# EAGLE design f280049_boost_robotics (EAGLE 9.1.3)

## Sheet 1 of 2
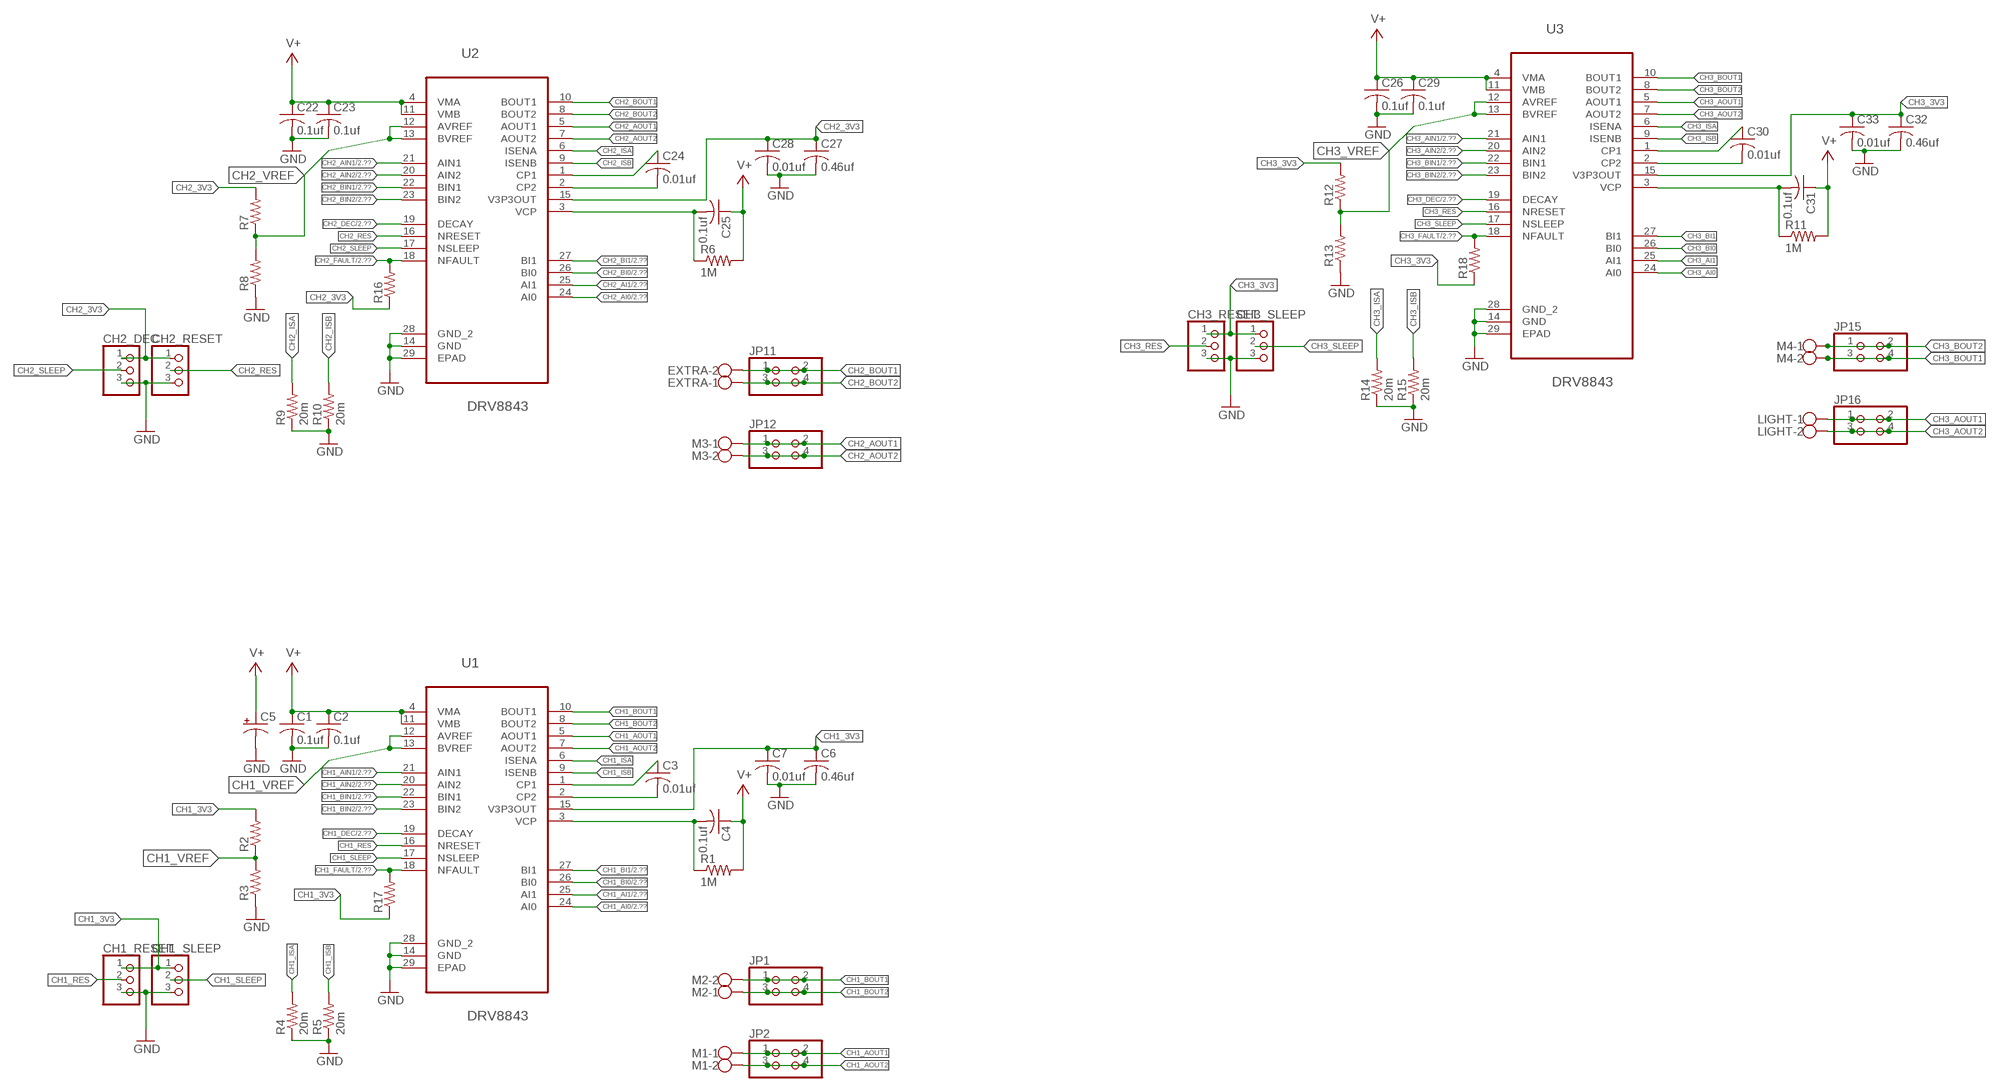
[diagram p0: schematic, sheet 1]

### Parts
C1  0.1uf  C-USC0603K  [C0603K]
C2  0.1uf  C-USC0603K  [C0603K]
C3  0.01uf  C-USC0603K  [C0603K]
C4  0.1uf  C-USC0603K  [C0603K]
C5  CPOL-USE5-8.5  [E5-8,5]
C6  0.46uf  C-USC0603K  [C0603K]
C7  0.01uf  C-USC0603K  [C0603K]
C22  0.1uf  C-USC0603K  [C0603K]
C23  0.1uf  C-USC0603K  [C0603K]
C24  0.01uf  C-USC0603K  [C0603K]
C25  0.1uf  C-USC0603K  [C0603K]
C26  0.1uf  C-USC0603K  [C0603K]
C27  0.46uf  C-USC0603K  [C0603K]
C28  0.01uf  C-USC0603K  [C0603K]
C29  0.1uf  C-USC0603K  [C0603K]
C30  0.01uf  C-USC0603K  [C0603K]
C31  0.1uf  C-USC0603K  [C0603K]
C32  0.46uf  C-USC0603K  [C0603K]
C33  0.01uf  C-USC0603K  [C0603K]
CH1_RESET  PINHD-1X3  [1X03]
CH1_SLEEP  PINHD-1X3  [1X03]
CH2_DEC  PINHD-1X3  [1X03]
CH2_RESET  PINHD-1X3  [1X03]
CH3_RESET  PINHD-1X3  [1X03]
CH3_SLEEP  PINHD-1X3  [1X03]
EXTRA  W237-102  [W237-102]
JP1  PINHD-2X2  [2X02]
JP2  PINHD-2X2  [2X02]
JP11  PINHD-2X2  [2X02]
JP12  PINHD-2X2  [2X02]
JP15  PINHD-2X2  [2X02]
JP16  PINHD-2X2  [2X02]
LIGHT  W237-102  [W237-102]
M1  W237-102  [W237-102]
M2  W237-102  [W237-102]
M3  W237-102  [W237-102]
M4  W237-102  [W237-102]
R1  1M  R-US_R0402  [R0402]
R2  R-US_R0402  [R0402]
R3  R-US_R0402  [R0402]
R4  20m  R-US_R0402  [R0402]
R5  20m  R-US_R0402  [R0402]
R6  1M  R-US_R0402  [R0402]
R7  R-US_R0402  [R0402]
R8  R-US_R0402  [R0402]
R9  20m  R-US_R0402  [R0402]
R10  20m  R-US_R0402  [R0402]
R11  1M  R-US_R0402  [R0402]
R12  R-US_R0402  [R0402]
R13  R-US_R0402  [R0402]
R14  20m  R-US_R0402  [R0402]
R15  20m  R-US_R0402  [R0402]
R16  R-US_R0402  [R0402]
R17  R-US_R0402  [R0402]
R18  R-US_R0402  [R0402]
U1  DRV8843  [SOP65P640X120-29N]
U2  DRV8843  [SOP65P640X120-29N]
U3  DRV8843  [SOP65P640X120-29N]

### Nets
CH1_3V3: C6.1 C7.1 CH1_RESET.1 CH1_SLEEP.1 R2.2 R17.1 U1.15(V3P3OUT)
CH1_AI0: U1.24(AI0) ; also sheet 2
CH1_AI1: U1.25(AI1) ; also sheet 2
CH1_AIN1: U1.21(AIN1) ; also sheet 2
CH1_AIN2: U1.20(AIN2) ; also sheet 2
CH1_AOUT1: JP2.1 JP2.2 M1.1 U1.5(AOUT1)
CH1_AOUT2: JP2.3 JP2.4 M1.2 U1.7(AOUT2)
CH1_BI0: U1.26(BI0) ; also sheet 2
CH1_BI1: U1.27(BI1) ; also sheet 2
CH1_BIN1: U1.22(BIN1) ; also sheet 2
CH1_BIN2: U1.23(BIN2) ; also sheet 2
CH1_BOUT1: JP1.1 JP1.2 M2.2 U1.10(BOUT1)
CH1_BOUT2: JP1.3 JP1.4 M2.1 U1.8(BOUT2)
CH1_DEC: U1.19(DECAY) ; also sheet 2
CH1_FAULT: R17.2 U1.18(NFAULT) ; also sheet 2
CH1_ISA: R4.2 U1.6(ISENA)
CH1_ISB: R5.2 U1.9(ISENB)
CH1_RES: CH1_RESET.2 U1.16(NRESET)
CH1_SLEEP: CH1_SLEEP.2 U1.17(NSLEEP)
CH1_VREF: R2.1 R3.2 U1.12(AVREF) U1.13(BVREF)
CH2_3V3: C27.1 C28.1 CH2_DEC.1 CH2_RESET.1 R7.2 R16.1 U2.15(V3P3OUT)
CH2_AI0: U2.24(AI0) ; also sheet 2
CH2_AI1: U2.25(AI1) ; also sheet 2
CH2_AIN1: U2.21(AIN1) ; also sheet 2
CH2_AIN2: U2.20(AIN2) ; also sheet 2
CH2_AOUT1: JP12.1 JP12.2 M3.1 U2.5(AOUT1)
CH2_AOUT2: JP12.3 JP12.4 M3.2 U2.7(AOUT2)
CH2_BI0: U2.26(BI0) ; also sheet 2
CH2_BI1: U2.27(BI1) ; also sheet 2
CH2_BIN1: U2.22(BIN1) ; also sheet 2
CH2_BIN2: U2.23(BIN2) ; also sheet 2
CH2_BOUT1: EXTRA.2 JP11.1 JP11.2 U2.10(BOUT1)
CH2_BOUT2: EXTRA.1 JP11.3 JP11.4 U2.8(BOUT2)
CH2_DEC: U2.19(DECAY) ; also sheet 2
CH2_FAULT: R16.2 U2.18(NFAULT) ; also sheet 2
CH2_ISA: R9.2 U2.6(ISENA)
CH2_ISB: R10.2 U2.9(ISENB)
CH2_RES: CH2_RESET.2 U2.16(NRESET)
CH2_SLEEP: CH2_DEC.2 U2.17(NSLEEP)
CH2_VREF: R7.1 R8.2 U2.12(AVREF) U2.13(BVREF)
CH3_3V3: C32.1 C33.1 CH3_RESET.1 CH3_SLEEP.1 R12.2 R18.1 U3.15(V3P3OUT)
CH3_AI0: U3.24(AI0)
CH3_AI1: U3.25(AI1)
CH3_AIN1: U3.21(AIN1) ; also sheet 2
CH3_AIN2: U3.20(AIN2) ; also sheet 2
CH3_AOUT1: JP16.1 JP16.2 LIGHT.1 U3.5(AOUT1)
CH3_AOUT2: JP16.3 JP16.4 LIGHT.2 U3.7(AOUT2)
CH3_BI0: U3.26(BI0)
CH3_BI1: U3.27(BI1)
CH3_BIN1: U3.22(BIN1) ; also sheet 2
CH3_BIN2: U3.23(BIN2) ; also sheet 2
CH3_BOUT1: JP15.3 JP15.4 M4.2 U3.10(BOUT1)
CH3_BOUT2: JP15.1 JP15.2 M4.1 U3.8(BOUT2)
CH3_DEC: U3.19(DECAY) ; also sheet 2
CH3_FAULT: R18.2 U3.18(NFAULT) ; also sheet 2
CH3_ISA: R14.2 U3.6(ISENA)
CH3_ISB: R15.2 U3.9(ISENB)
CH3_RES: CH3_RESET.2 U3.16(NRESET)
CH3_SLEEP: CH3_SLEEP.2 U3.17(NSLEEP)
CH3_VREF: R12.1 R13.2 U3.12(AVREF) U3.13(BVREF)
GND: C1.2 C2.2 C5.- C6.2 C7.2 C22.2 C23.2 C26.2 C27.2 C28.2 C29.2 C32.2 C33.2 CH1_RESET.3 CH1_SLEEP.3 CH2_DEC.3 CH2_RESET.3 CH3_RESET.3 CH3_SLEEP.3 R3.1 R4.1 R5.1 R8.1 R9.1 R10.1 R13.1 R14.1 R15.1 U1.14(GND) U1.28(GND_2) U1.29(EPAD) U2.14(GND) U2.28(GND_2) U2.29(EPAD) U3.14(GND) U3.28(GND_2) U3.29(EPAD) ; also sheet 2
N$1: C3.1 U1.1(CP1)
N$2: C3.2 U1.2(CP2)
N$3: C4.2 R1.1 U1.3(VCP)
N$4: C24.1 U2.1(CP1)
N$5: C24.2 U2.2(CP2)
N$15: C25.2 R6.1 U2.3(VCP)
N$16: C30.1 U3.1(CP1)
N$17: C30.2 U3.2(CP2)
N$18: C31.2 R11.1 U3.3(VCP)
V+: C1.1 C2.1 C4.1 C5.+ C22.1 C23.1 C25.1 C26.1 C29.1 C31.1 R1.2 R6.2 R11.2 U1.4(VMA) U1.11(VMB) U2.4(VMA) U2.11(VMB) U3.4(VMA) U3.11(VMB) ; also sheet 2

## Sheet 2 of 2
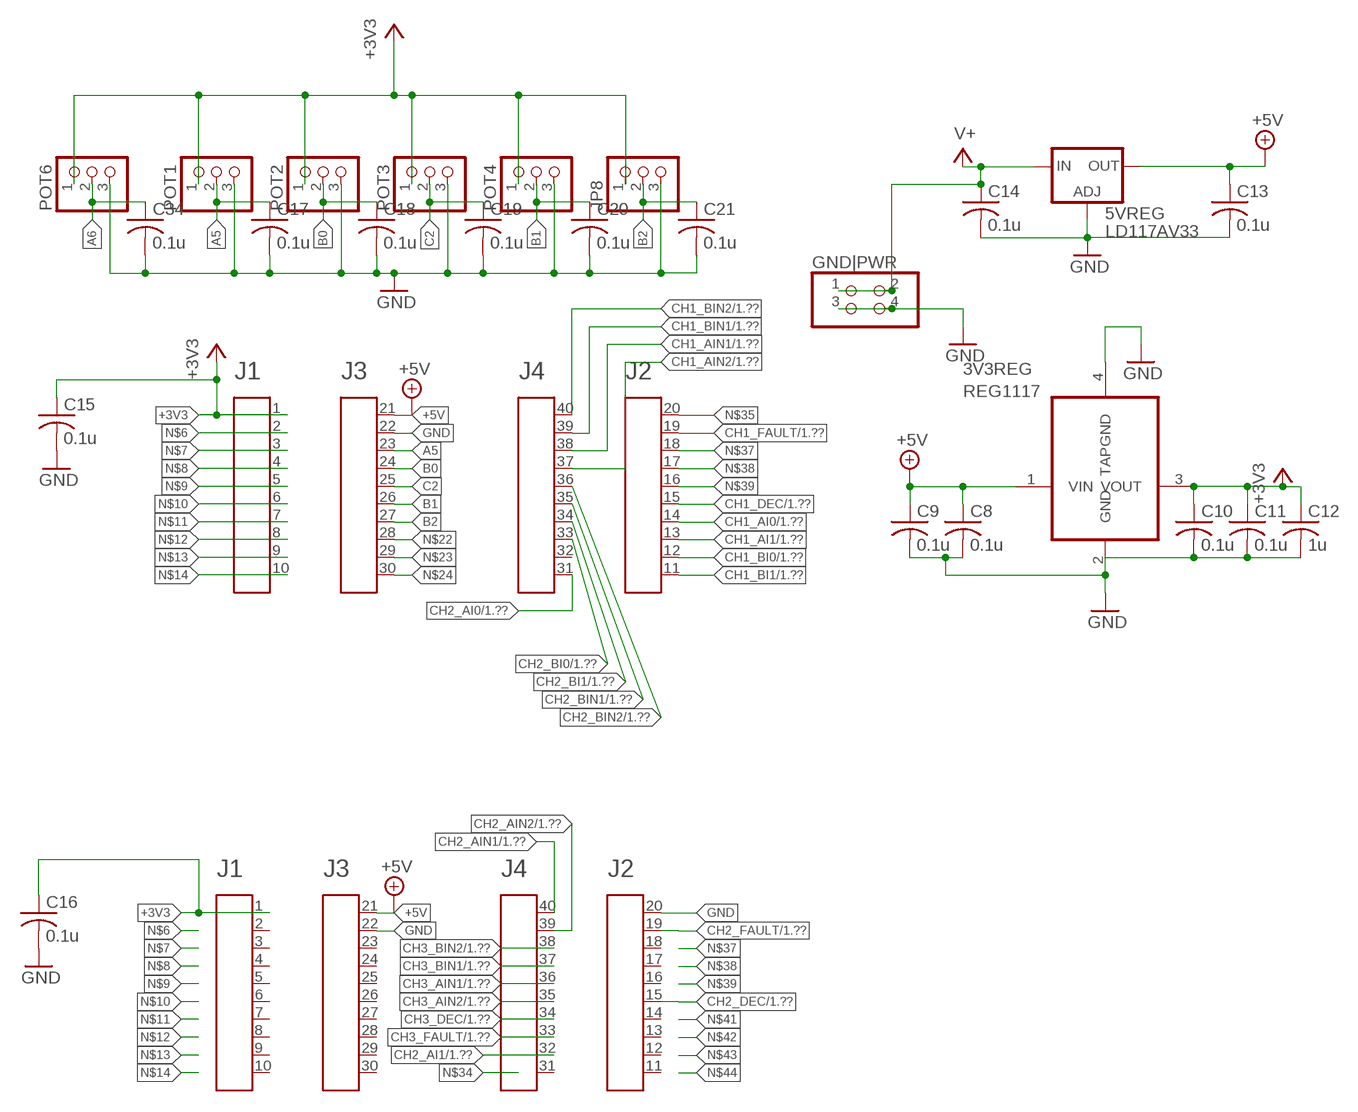
[diagram p1: schematic, sheet 2]

### Parts
3V3REG  REG1117  [SOT223]
5VREG  LD117AV33  [TO220L1]
A1  HEADER4X10-BOOSTERPACK  [4X10-BOOSTERPACK]
A2  HEADER4X10-BOOSTERPACK  [4X10-BOOSTERPACK]
C8  0.1u  C-USC0603K  [C0603K]
C9  0.1u  C-USC0603K  [C0603K]
C10  0.1u  C-USC0603K  [C0603K]
C11  0.1u  C-USC0603K  [C0603K]
C12  1u  C-USC0805K  [C0805K]
C13  0.1u  C-USC0603K  [C0603K]
C14  0.1u  C-USC0603K  [C0603K]
C15  0.1u  C-USC0603K  [C0603K]
C16  0.1u  C-USC0603K  [C0603K]
C17  0.1u  C-USC0603K  [C0603K]
C18  0.1u  C-USC0603K  [C0603K]
C19  0.1u  C-USC0603K  [C0603K]
C20  0.1u  C-USC0603K  [C0603K]
C21  0.1u  C-USC0603K  [C0603K]
C34  0.1u  C-USC0603K  [C0603K]
GND|PWR  PINHD-2X2  [2X02]
JP8  PINHD-1X3  [1X03]
POT1  PINHD-1X3  [1X03]
POT2  PINHD-1X3  [1X03]
POT3  PINHD-1X3  [1X03]
POT4  PINHD-1X3  [1X03]
POT6  PINHD-1X3  [1X03]

### Nets
+3V3: 3V3REG.3(VOUT) A1.1 A2.1 C10.1 C11.1 C12.1 C15.1 C16.1 JP8.1 POT1.1 POT2.1 POT3.1 POT4.1 POT6.1
+5V: 3V3REG.1(VIN) 5VREG.2(OUT) A1.21 A2.21 C8.1 C9.1 C13.1
A5: A2.23 C17.1 POT1.2
A6: C34.1 POT6.2
B0: A2.24 C18.1 POT2.2
B1: A2.26 C20.1 POT4.2
B2: A2.27 C21.1 JP8.2
C2: A2.25 C19.1 POT3.2
CH1_AI0: A2.14 ; also sheet 1
CH1_AI1: A2.13 ; also sheet 1
CH1_AIN1: A2.38 ; also sheet 1
CH1_AIN2: A2.37 ; also sheet 1
CH1_BI0: A2.12 ; also sheet 1
CH1_BI1: A2.11 ; also sheet 1
CH1_BIN1: A2.39 ; also sheet 1
CH1_BIN2: A2.40 ; also sheet 1
CH1_DEC: A2.15 ; also sheet 1
CH1_FAULT: A2.19 ; also sheet 1
CH2_AI0: A2.31 ; also sheet 1
CH2_AI1: A1.32 ; also sheet 1
CH2_AIN1: A1.40 ; also sheet 1
CH2_AIN2: A1.39 ; also sheet 1
CH2_BI0: A2.33 ; also sheet 1
CH2_BI1: A2.34 ; also sheet 1
CH2_BIN1: A2.35 ; also sheet 1
CH2_BIN2: A2.36 ; also sheet 1
CH2_DEC: A1.15 ; also sheet 1
CH2_FAULT: A1.19 ; also sheet 1
CH3_AIN1: A1.36 ; also sheet 1
CH3_AIN2: A1.35 ; also sheet 1
CH3_BIN1: A1.37 ; also sheet 1
CH3_BIN2: A1.38 ; also sheet 1
CH3_DEC: A1.34 ; also sheet 1
CH3_FAULT: A1.33 ; also sheet 1
GND: 3V3REG.2(GND) 3V3REG.4(TAPGND) 5VREG.1(ADJ) A1.20 A1.22 A2.22 C8.2 C9.2 C10.2 C11.2 C12.2 C13.2 C14.2 C15.2 C16.2 C17.2 C18.2 C19.2 C20.2 C21.2 C34.2 GND|PWR.3 GND|PWR.4 JP8.3 POT1.3 POT2.3 POT3.3 POT4.3 POT6.3 ; also sheet 1
N$6: A2.2
N$7: A2.3
N$8: A2.4
N$9: A2.5
N$10: A2.6
N$11: A2.7
N$12: A2.8
N$13: A2.9
N$14: A2.10
N$22: A2.28
N$23: A2.29
N$24: A2.30
N$35: A2.20
N$37: A2.18
N$38: A2.17
N$39: A2.16
V+: 5VREG.3(IN) C14.1 GND|PWR.1 GND|PWR.2 ; also sheet 1
Unconnected: A1.2 A1.3 A1.4 A1.5 A1.6 A1.7 A1.8 A1.9 A1.10 A1.11 A1.12 A1.13 A1.14 A1.16 A1.17 A1.18 A1.23 A1.24 A1.25 A1.26 A1.27 A1.28 A1.29 A1.30 A1.31 A2.32

## Library data of the parts
3V3REG = MSP-EXP430F5529LP:REG1117: 800mA and 1A Low Dropout (LDO) Positive Regulator 1.8V, 2.5V, 2.85V, 3.3V, 5V, and Adj; MPN: REG1117; OC_FARNELL: 1097566; OC_NEWARK: 14P6981
5VREG = v-reg:LD117A?*: Low drop fixed and adjustable positive voltage regulators 1 A Source: http://www.st.com/stonline/products/literature/ds/7194/ld1117axx.pdf
A1 A2 = EAGLE_BoosterPack_Library:HEADER4X10-BOOSTERPACK
C1-C4 C6-C34 = rcl:C-US: CAPACITOR, American symbol; SPICEPREFIX: C
C5 = rcl:CPOL-US: POLARIZED CAPACITOR, American symbol; SPICEPREFIX: C
CH1_RESET CH1_SLEEP CH2_DEC CH2_RESET CH3_RESET CH3_SLEEP JP8 POT1-POT4 POT6 = adafruit:PINHD-1X3: PIN HEADER
EXTRA LIGHT M1-M4 = con-wago-500:W237-102: WAGO SCREW CLAMP; MPN: 237-102; OC_FARNELL: unknown; OC_NEWARK: 70K9898
GND|PWR JP1 JP2 JP11 JP12 JP15 JP16 = pinhead:PINHD-2X2: PIN HEADER
R1-R18 = rcl:R-US_: RESISTOR, American symbol; SPICEPREFIX: R
U1-U3 = Texas Instruments_By_element14_Batch_1:DRV8843: H-BRIDGE MOTOR CONTROLLER IC; MPN: DRV8828PWP; OC_FARNELL: -; OC_NEWARK: 79R7959; PACKAGE: TSSOP-28; SUPPLIER: Texas Instruments

## Board
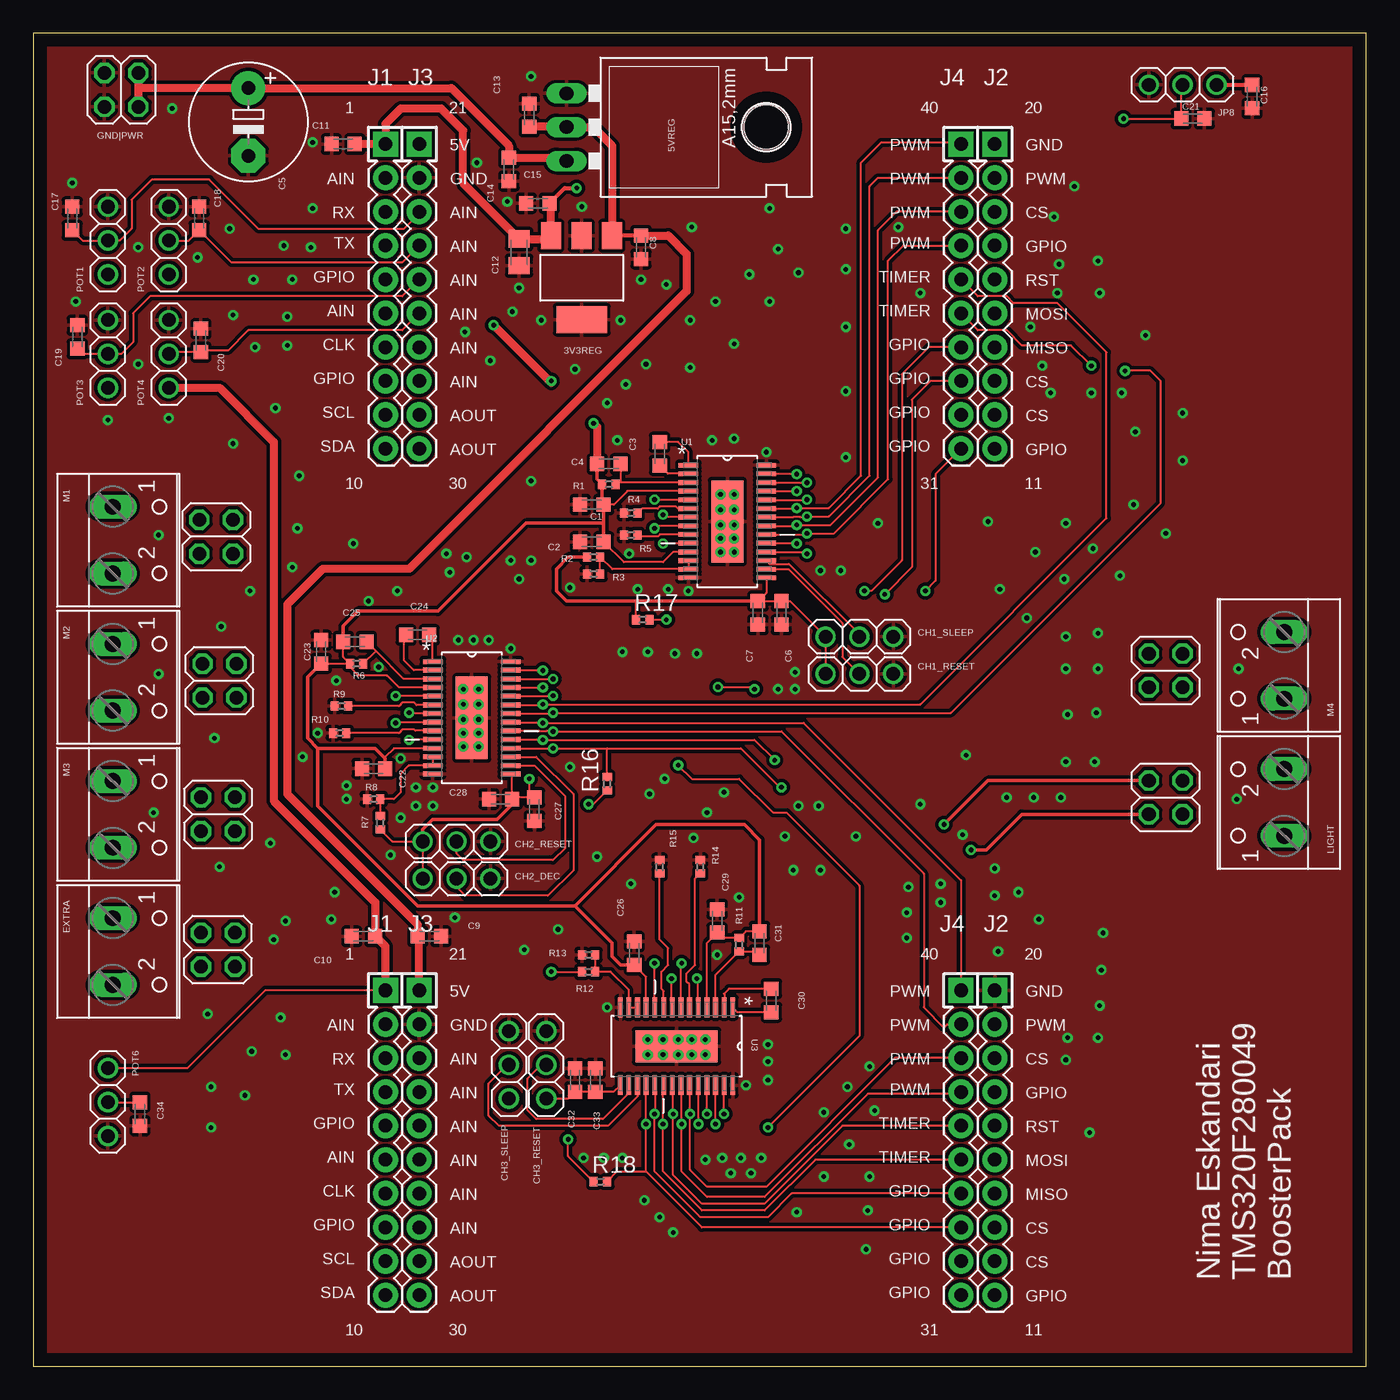
[diagram p2: board, top side]
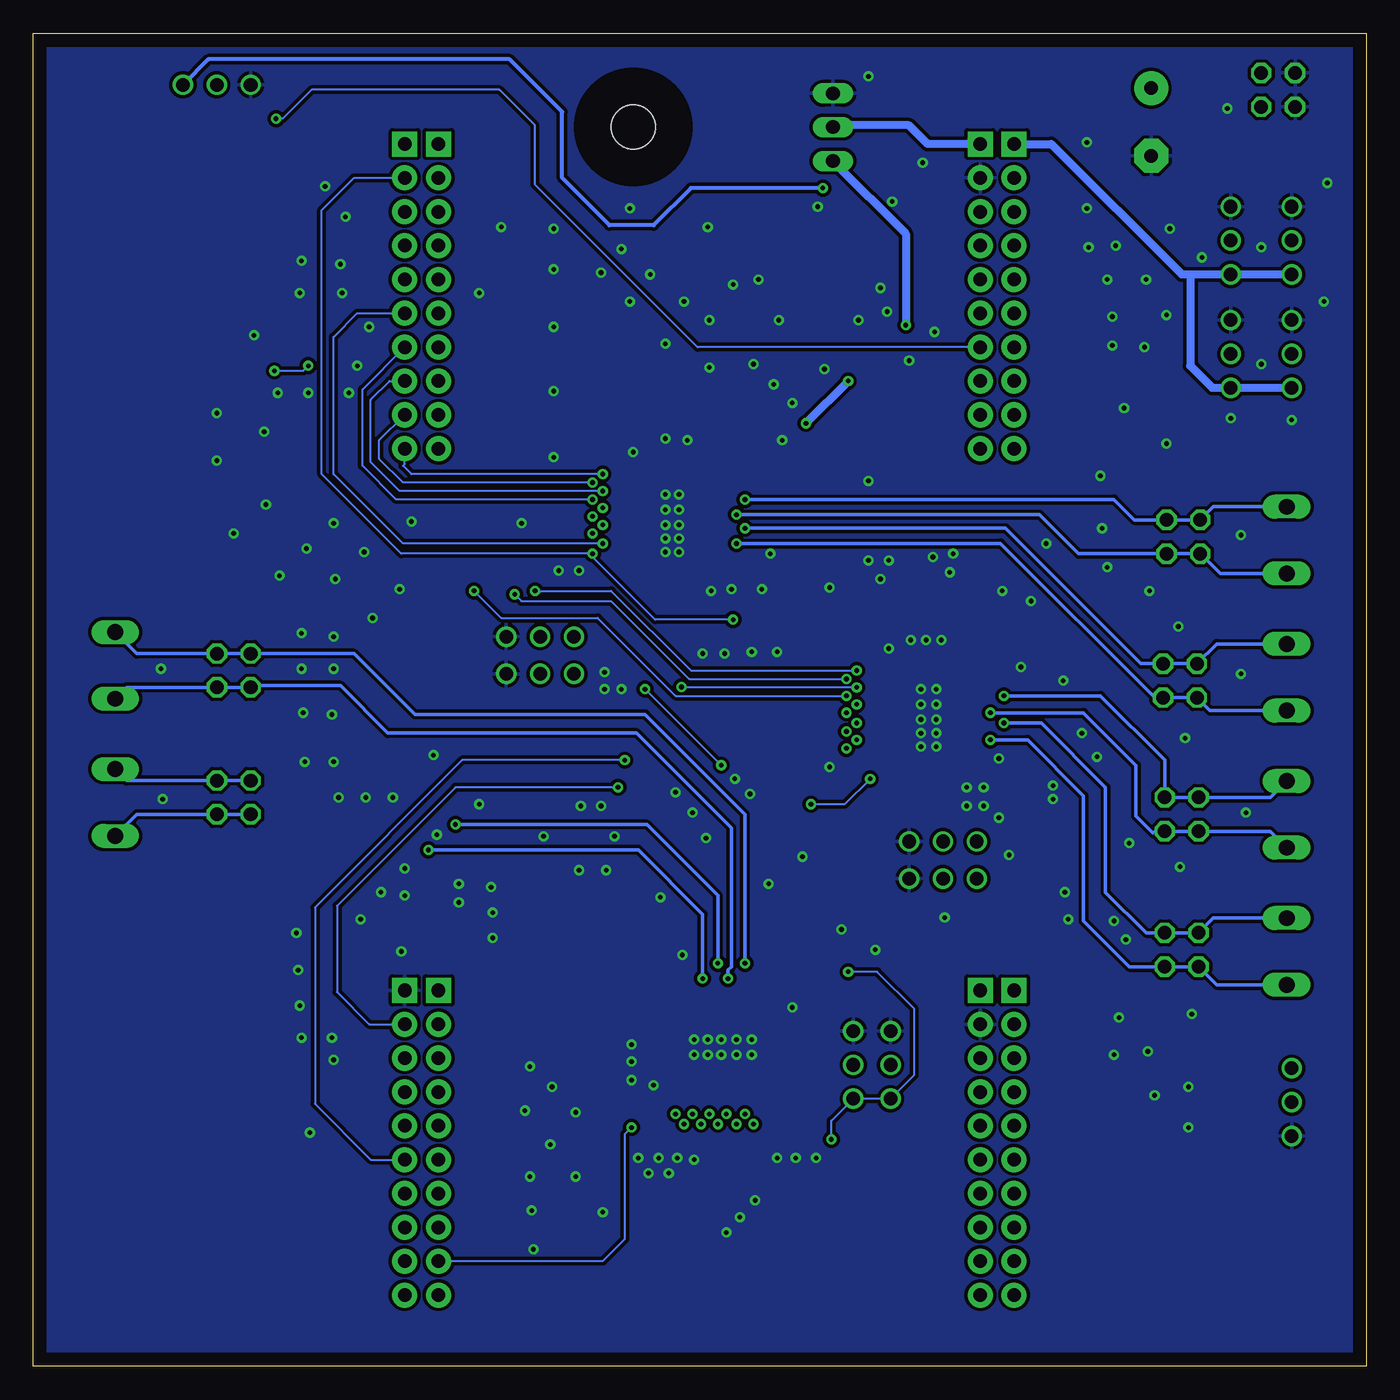
[diagram p3: board, bottom side, seen from below]

Size 100 x 100 mm. Coordinates in mm from the lower left corner, seen from the top.
Outline: 0,0 100,0 100,100 0,100 0,0
Copper layers (1*16): Top 0.035mm / dielectric 1.5mm / Bottom 0.035mm
Design rules "default": minimum track width 6mil, minimum drill 0.35mm, track to track 6mil, track to pad 6mil, pad to pad 6mil, via to via 6mil, smd to smd 6mil, copper to edge 40mil, drill to drill 6mil, minimum pad ring 10mil, minimum via ring 8mil, stop-mask expansion 4mil, vias tented up to drill 0mil, thermal gap 10mil

### Footprints (pad centres in the part's own frame; a part is rotated, then mirrored left to right if it is on the bottom)
SOT223 = smd 1.499 x 2.007: 1 -2.261,-3.15; 2 0.025,-3.15; 3 2.311,-3.15 | smd 3.81 x 2.007: 4 0,3.15
TO220L1 = drill 1.016 long: 1 -2.54,-3.81; 2 0,-3.81; 3 2.54,-3.81 | hole 3.302: 0,11.176
4X10-BOOSTERPACK = drill 1.016 pad 1.88 square: 1 0,10.16; 20 45.72,10.16; 21 2.54,10.16; 40 43.18,10.16 | drill 1.016 pad 1.88: 2 0,7.62; 3 0,5.08; 4 0,2.54; 5 0,0; 6 0,-2.54; 7 0,-5.08; 8 0,-7.62; 9 0,-10.16; 10 0,-12.7; 11 45.72,-12.7; 12 45.72,-10.16; 13 45.72,-7.62; 14 45.72,-5.08; 15 45.72,-2.54; 16 45.72,0; 17 45.72,2.54; 18 45.72,5.08; 19 45.72,7.62; 22 2.54,7.62; 23 2.54,5.08; 24 2.54,2.54; 25 2.54,0; 26 2.54,-2.54; 27 2.54,-5.08; 28 2.54,-7.62; 29 2.54,-10.16; 30 2.54,-12.7; 31 43.18,-12.7; 32 43.18,-10.16; 33 43.18,-7.62; 34 43.18,-5.08; 35 43.18,-2.54; 36 43.18,0; 37 43.18,2.54; 38 43.18,5.08; 39 43.18,7.62
C0603K = smd 1.05 x 1.08: 1 -0.875,0; 2 0.875,0
E5-8,5 = drill 1.016 pad 2.54: + -2.54,0 | drill 1.016 pad 2.54 octagon: - 2.54,0
C0805K = smd 1.3 x 1.6: 1 -1,0; 2 1,0
1X03 = drill 1.016: 1 -2.54,0; 2 0,0; 3 2.54,0
W237-102 = drill 1.194 long: 1 -2.5,-1.27; 2 2.5,-1.27
2X02 = drill 1.016 octagon: 1 -1.27,-1.27; 2 -1.27,1.27; 3 1.27,-1.27; 4 1.27,1.27
R0402 = smd 0.6 x 0.7: 1 -0.5,0; 2 0.5,0
SOP65P640X120-29N = smd 1.473 x 0.356: 1 -2.921,4.216; 2 -2.921,3.581; 3 -2.921,2.921; 4 -2.921,2.286; 5 -2.921,1.626; 6 -2.921,0.965; 7 -2.921,0.33; 8 -2.921,-0.33; 9 -2.921,-0.965; 10 -2.921,-1.626; 11 -2.921,-2.286; 12 -2.921,-2.921; 13 -2.921,-3.581; 14 -2.921,-4.216; 15 2.921,-4.216; 16 2.921,-3.581; 17 2.921,-2.921; 18 2.921,-2.286; 19 2.921,-1.626; 20 2.921,-0.965; 21 2.921,-0.33; 22 2.921,0.33; 23 2.921,0.965; 24 2.921,1.626; 25 2.921,2.286; 26 2.921,2.921; 27 2.921,3.581; 28 2.921,4.216 | smd 2.388 x 6.172: 29 0,0

### Placement (x,y rotation side)
3V3REG  41.15,81.66 180 top
5VREG  43.81,92.96 270 top
A1  26.42,18.03 0 top
A2  26.42,81.53 0 top
C1  41.91,64.64 180 top
C2  41.91,61.85 180 top
C3  46.99,68.45 270 top
C4  43.18,67.69 0 top
C5  16.13,93.34 270 top
C6  56.13,56.52 270 top
C7  54.36,56.52 270 top
C8  45.59,83.95 270 top
C9  29.72,32.26 0 top
C10  24.77,32.26 180 top
C11  23.24,91.69 180 top
C12  36.45,83.57 270 top
C13  37.21,93.85 90 top
C14  35.69,89.79 270 top
C15  37.85,87.25 180 top
C16  91.44,95.25 270 top
C17  2.92,86.11 90 top
C18  12.45,86.11 90 top
C19  3.3,77.22 90 top
C20  12.57,76.96 90 top
C21  87,93.6 0 top
C22  25.53,44.83 180 top
C23  21.59,53.59 90 top
C24  28.83,54.86 180 top
C25  24.13,54.36 0 top
C26  45.09,30.99 90 top
C27  37.59,41.78 270 top
C28  35.05,42.55 180 top
C29  51.31,33.4 90 top
C30  55.37,27.43 90 top
C31  54.48,31.75 270 top
C32  40.64,21.46 90 top
C33  42.16,21.46 90 top
C34  8,18.92 270 top
CH1_RESET  61.98,51.94 0 top
CH1_SLEEP  61.98,54.74 0 top
CH2_DEC  31.75,36.58 0 top
CH2_RESET  31.75,39.37 0 top
CH3_RESET  38.48,22.61 90 top
CH3_SLEEP  35.69,22.61 90 top
EXTRA  7.24,31.11 270 top
GND|PWR  6.6,95.76 180 top
JP1  13.97,51.44 90 top
JP2  13.72,62.23 270 top
JP8  86.23,96.14 180 top
JP11  13.84,31.24 90 top
JP12  13.84,41.4 270 top
JP15  84.96,52.2 90 top
JP16  84.96,42.67 90 top
LIGHT  92.58,42.29 90 top
M1  7.24,61.98 270 top
M2  7.24,51.69 270 top
M3  7.24,41.4 270 top
M4  92.58,52.58 90 top
POT1  5.59,84.45 90 top
POT2  10.16,84.45 90 top
POT3  5.59,75.95 90 top
POT4  10.16,75.95 90 top
POT6  5.59,19.81 270 top
R1  43.18,66.17 180 top
R2  42.04,60.71 180 top
R3  42.04,59.44 0 top
R4  44.83,64.01 0 top
R5  44.83,62.36 0 top
R6  24.26,52.7 180 top
R7  26.04,40.77 270 top
R8  25.53,42.55 0 top
R9  23.11,49.53 0 top
R10  22.99,47.5 0 top
R11  52.96,31.62 90 top
R12  41.66,29.59 180 top
R13  41.66,30.86 0 top
R14  50.04,37.47 270 top
R15  46.99,37.47 270 top
R16  43.05,43.69 90 top
R17  45.72,56.01 0 top
R18  42.55,13.84 0 top
U1  52.07,63.37 0 top
U2  32.89,48.64 0 top
U3  48.26,24 270 top

### Tracks (layer width: path | path; a pad name or v marks a point on that pad's centre or on a via)
+3V3  (via drill 0.35 pad 0.55)
  Top 0.152: A1.1 17.4,28.19 11.56,22.35 POT6.1
  Top 0.305: C15.1 39.86,88.39 v40.77,88.39 | C16.1 88.79,96.12 JP8.1
  Top 0.61: C15.1 38.84,87.13 3V3REG.3 38.59,84.57 C12.1 32.26,88.76 32.26,92.71 30.61,94.36 27.56,94.36 26.42,93.22 A2.1 C11.1 | POT4.1 13.97,73.41 18.03,69.34 18.03,42.42 25.65,34.8 25.65,32.27 | 25.65,32.27 C10.1 | A1.1 26.42,31.51 25.65,32.27
  Bottom 0.305: v40.77,88.39 50.67,88.39 53.47,85.6 56.77,85.6 60.33,89.15 60.33,94.11 64.26,98.04 86.87,98.04 JP8.1
  Bottom 0.61: A2.1 23.62,91.69 13.84,81.92 13.21,81.92 | 13.21,81.92 POT2.1 POT1.1 | 13.21,81.92 13.21,75.06 11.56,73.41 POT4.1 POT3.1
+5V
  Top 0.305: C8.1 43.42,84.82 3V3REG.1
  Top 0.61: 3V3REG.1 43.43,84.84 43.43,91.57 42.04,92.96 5VREG.2 39.99,92.98 C13.1 | C8.1 47.64,84.82 49.02,83.44 49.02,80.64 28.19,59.82 21.72,59.82 19.05,57.15 19.05,42.93 28.84,33.13 C9.1 28.96,32.15 A1.21
  Bottom 0.61: A2.21 32.89,91.69 34.29,93.09 39.88,93.09 5VREG.2
A5
  Top 0.152: A2.23 28.96,86.49 27.79,85.32 16.92,85.32 13.21,89.03 8.89,89.03 7.37,87.5 7.37,85.34 6.48,84.45 POT1.2 3.7,84.45 C17.1
A6
  Top 0.152: POT6.2 7.99,19.81 C34.1
B0
  Top 0.152: A2.24 27.69,82.8 14.87,82.8 C18.1 11.67,84.45 POT2.2
B1
  Top 0.152: A2.26 27.69,77.72 16.13,77.72 14.61,76.2 12.69,76.2 C20.1 10.3,76.09 POT4.2
B2  (via drill 0.35 pad 0.55)
  Top 0.152: JP8.2 86.12,96.03 C21.1 v81.79,93.6
  Bottom 0.152: A2.27 50.16,76.45 62.36,88.65 62.36,93.09 65.02,95.76 79.12,95.76 81.28,93.6 v81.79,93.6
C2
  Top 0.152: A2.25 27.69,80.26 8.76,80.26 7.49,78.99 7.49,76.83 6.6,75.95 POT3.2 3.7,75.95 C19.1
CH1_3V3
  Top 0.152: U1.15 54.99,58.02 C7.1 C6.1 56.78,57.39 CH1_SLEEP.1 CH1_RESET.1 | R17.1 45.21,57.39
  Top 0.254: R2.2 40.13,60.71 39.24,59.82 39.24,58.17 40.02,57.39 45.21,57.39 C7.1
CH1_AI0  (via drill 0.35)
  Top 0.152: U1.24 58.01,65 v58.04,65.02
  Bottom 0.152: v58.04,65.02 72.77,65.02 75.31,67.56 75.31,73.28 A2.14
CH1_AI1  (via drill 0.35)
  Top 0.152: U1.25 v57.28,65.66
  Bottom 0.152: v57.28,65.66 72.52,65.66 74.68,67.82 74.68,72.52 73.28,73.91 A2.13
CH1_AIN1  (via drill 0.35)
  Top 0.152: U1.21 57.2,63.04 v57.28,63.12 59.82,63.12 63.37,66.67 63.37,85.22 64.77,86.61 A2.38
CH1_AIN2  (via drill 0.35)
  Top 0.152: U1.20 57.96,62.41 v58.04,62.48 60.07,62.48 64.14,66.55 64.14,82.93 65.28,84.07 A2.37
CH1_AOUT1  (via drill 0.35 pad 0.55)
  Top 0.152: U1.5 46.63,65 v46.61,65.02
  Bottom 0.254: v46.61,65.02 18.92,65.02 17.4,63.5 JP2.2 JP2.1 11.47,64.48 M1.1
CH1_AOUT2  (via drill 0.35 pad 0.55)
  Top 0.152: U1.7 47.42,63.7 v47.24,63.88
  Bottom 0.254: v47.24,63.88 24.51,63.88 21.59,60.96 JP2.4 JP2.3 10.96,59.48 M1.2
CH1_BI0  (via drill 0.35)
  Top 0.152: U1.26 v58.04,66.29
  Bottom 0.152: v58.04,66.29 72.26,66.29 74.04,68.07 74.04,69.47 A2.12
CH1_BI1  (via drill 0.35 pad 0.55)
  Top 0.152: U1.27 57.25,66.95 v57.28,66.93
  Bottom 0.152: v57.28,66.93 71.63,66.93 72.26,67.56 72.14,67.69 A2.11
CH1_BIN1  (via drill 0.35)
  Top 0.152: U1.22 57,63.7 57.03,63.73 57.53,63.73 57.55,63.7 57.99,63.7 v58.04,63.75 59.69,63.75 62.74,66.8 62.74,88.52 63.37,89.15 A2.39
CH1_BIN2  (via drill 0.35)
  Top 0.152: U1.23 57.23,64.34 v57.28,64.39 59.69,64.39 62.1,66.8 62.1,90.3 63.63,91.82 69.47,91.82 A2.40
CH1_BOUT1  (via drill 0.35 pad 0.55)
  Top 0.152: U1.10 49.12,61.72 v47.24,61.72
  Bottom 0.254: v47.24,61.72 27.43,61.72 15.88,50.16 JP1.1 JP1.2 11.72,49.19 M2.2
CH1_BOUT2  (via drill 0.35 pad 0.55)
  Top 0.152: U1.8 46.79,63.04 v46.61,62.87
  Bottom 0.254: v46.61,62.87 27.05,62.87 16.89,52.7 JP1.3 JP1.4 11.22,54.19 M2.1
CH1_DEC  (via drill 0.35)
  Top 0.152: U1.19 57.25,61.75 v57.28,61.72
  Bottom 0.152: v57.28,61.72 72.26,61.72 77.47,66.93 77.47,77.22 75.69,78.99 A2.15
CH1_FAULT  (via drill 0.35)
  Top 0.152: U1.18 57.91,61.09 v58.04,60.96 | R17.2 v47.5,56.01 47.62,56.01
  Bottom 0.152: A2.19 75.95,89.15 78.36,86.74 78.36,66.93 72.39,60.96 v58.04,60.96 58.04,60.71 53.34,56.01 v47.5,56.01
CH1_ISA
  Top 0.152: R4.2 45.66,64.34 46.84,64.34 46.99,64.49 48.24,64.49 48.39,64.34 U1.6
CH1_ISB
  Top 0.152: U1.9 47.01,62.41 46.86,62.26 45.43,62.26 R5.2
CH1_RES
  Top 0.152: U1.16 56.67,59.79 60.71,55.75 60.71,53.21 CH1_RESET.2
CH1_SLEEP
  Top 0.152: U1.17 55.24,60.2 56.69,60.2 61.98,54.91 CH1_SLEEP.2
CH1_VREF
  Top 0.152: U1.12 U1.13 43.45,59.79 R2.1 R3.2
CH2_3V3  (via drill 0.35)
  Top 0.152: R7.2 26.93,39.37 CH2_RESET.1 CH2_DEC.1 | C28.1 35.93,42.67 | 35.93,42.67 35.93,44.31 U2.15 | C27.1 37.47,42.66 | 37.47,42.66 35.94,42.66 35.93,42.67 | R16.1 42.03,42.16 v41.66,42.16 | v37.21,44.07 37.21,42.91 37.47,42.66
  Top 0.254: C28.1 35.93,42.15 34.8,41.02 29.97,41.02 29.21,40.26 CH2_RESET.1
  Bottom 0.152: v41.66,42.16 39.12,42.16 v37.21,44.07
CH2_AI0  (via drill 0.35)
  Top 0.152: U2.24 38.96,50.27 v38.99,50.29 | A2.31 67.69,66.93 67.69,58.93 v66.93,58.17
  Bottom 0.152: v66.93,58.17 64.9,56.13 57.66,56.13 51.82,50.29 v38.99,50.29
CH2_AI1  (via drill 0.35)
  Top 0.152: U2.25 v38.23,50.93 | v51.37,50.95 53.95,50.95 v54.1,50.8 | v48.39,45.09 49.4,44.07 52.96,44.07 55.5,41.53 56.52,41.53 61.98,36.07 61.98,24.77 v55.12,17.91
  Bottom 0.152: v51.37,50.95 51.34,50.93 v38.23,50.93 | v54.1,50.8 v48.39,45.09 | v55.12,17.91 55.63,17.4 55.63,9.53 57.28,7.87 A1.32
CH2_AIN1  (via drill 0.35)
  Top 0.152: U2.21 38.18,48.31 v38.23,48.26 57.78,48.26 69.6,36.45 A1.40
CH2_AIN2  (via drill 0.35)
  Top 0.152: U2.20 37.95,47.68 37.98,47.65 38.48,47.65 38.5,47.68 38.94,47.68 v38.99,47.62 56.13,47.62 66.8,36.96 66.8,26.92 68.33,25.4 68.58,25.65 A1.39
CH2_AOUT1  (via drill 0.35)
  Top 0.152: U2.5 29.95,50.29 v27.18,50.29
  Bottom 0.254: v27.18,50.29 19.94,50.29 15.11,45.47 JP12.2 JP12.1 7.2,42.67 M3.1
CH2_AOUT2  (via drill 0.35)
  Top 0.152: U2.7 28.25,48.97 v28.19,49.02
  Bottom 0.254: v28.19,49.02 21.21,49.02 17.27,45.09 17.27,41.27 16,40.01 15.88,40.13 JP12.4 JP12.3 7.2,40.13 M3.2
CH2_BI0  (via drill 0.35)
  Top 0.152: U2.26 v38.99,51.56 | A2.33 67.31,73.91 65.91,72.52 65.91,59.94 v63.88,57.91
  Bottom 0.152: v63.88,57.91 63.37,57.4 56.64,57.4 50.8,51.56 v38.99,51.56
CH2_BI1  (via drill 0.35)
  Top 0.152: U2.27 38.2,52.22 v38.23,52.2 | A2.34 67.18,76.45 65.15,74.42 65.15,60.45 62.87,58.17 v62.36,58.17
  Bottom 0.152: v62.36,58.17 56.64,58.17 50.67,52.2 v38.23,52.2
CH2_BIN1  (via drill 0.35)
  Top 0.152: U2.22 38.94,48.97 v38.99,49.02 68.83,49.02 84.58,64.77 84.58,73.91 83.82,74.68 v81.92,74.68 | v79.38,75.06 77.85,76.58 74.17,76.58 73.03,77.72 70.87,77.72 A2.35
  Bottom 0.152: v81.92,74.68 79.76,74.68 v79.38,75.06
CH2_BIN2  (via drill 0.35)
  Top 0.152: U2.23 38.18,49.61 v38.23,49.66 66.55,49.66 80.52,63.63 80.52,76.07 76.83,79.76 73.53,79.76 73.03,80.26 70.87,80.26 A2.36
CH2_BOUT1  (via drill 0.35)
  Top 0.152: U2.10 28.22,47.02 v28.19,46.99
  Bottom 0.254: v28.19,46.99 25.4,46.99 21.21,42.8 21.21,33.4 17.78,29.97 JP11.1 JP11.2 11.22,28.61 EXTRA.2
CH2_BOUT2  (via drill 0.35)
  Top 0.152: U2.8 27.23,48.31 v27.18,48.26
  Bottom 0.254: v27.18,48.26 24.38,48.26 19.56,43.43 19.56,35.56 16.51,32.51 JP11.3 JP11.4 11.47,33.62 EXTRA.1
CH2_DEC  (via drill 0.35)
  Top 0.152: U2.19 38.2,47.02 v38.23,46.99 54.1,46.99 v55.63,45.47
  Bottom 0.152: v55.63,45.47 67.82,45.47 78.87,34.42 78.87,19.68 74.68,15.49 A1.15
CH2_FAULT  (via drill 0.35)
  Top 0.152: U2.18 v38.99,46.35 43.05,46.35 | 43.05,46.35 53.09,46.35 56.01,43.43 v56.13,43.43 | R16.2 43.05,46.35
  Bottom 0.152: v56.13,43.43 68.33,43.43 77.22,34.54 77.22,28.07 74.8,25.65 A1.19
CH2_ISA
  Top 0.152: U2.6 28.75,49.61 28.57,49.78 27.69,49.78 27.43,49.53 R9.2
CH2_ISB
  Top 0.152: U2.9 28.65,47.68 28.57,47.75 27.69,47.75 27.43,47.5 R10.2
CH2_RES
  Top 0.152: U2.16 37.62,45.06 39.88,42.8 39.88,38.86 38.99,37.97 32.26,37.97 31.75,38.48 CH2_RESET.2
CH2_SLEEP
  Top 0.152: U2.17 37.72,45.72 40.51,42.93 40.51,37.21 38.61,35.31 32.38,35.31 31.75,35.94 CH2_DEC.2
CH2_VREF
  Top 0.152: U2.12 U2.13 28.17,45.06 27.56,44.45 27.56,43.05 27.05,42.55 R8.2 26.03,41.27 R7.1
CH3_3V3  (via drill 0.35)
  Top 0.152: U3.15 43.55,20.59 C33.1 C32.1 40.12,20.07 CH3_RESET.1 | v38.86,29.59 R12.2 | R18.1 40.13,15.76 v40.13,17.02
  Bottom 0.152: v38.86,29.59 36.7,29.59 33.91,26.8 33.91,21.84 CH3_SLEEP.1 CH3_RESET.1 40.13,18.41 v40.13,17.02
CH3_AI0  (via drill 0.35)
  Top 0.152: v49.91,18.16 49.91,21.06 U3.24
CH3_AI1  (via drill 0.35)
  Top 0.152: v50.55,18.92 U3.25
CH3_AIN1  (via drill 0.35)
  Top 0.152: U3.21 48.01,21.01 v48.01,18.92 48.01,14.35 50.16,12.19 54.86,12.19 60.71,18.03 A1.36
CH3_AIN2  (via drill 0.35)
  Top 0.152: U3.20 47.24,21.03 v47.24,18.16 47.24,14.61 50.16,11.68 54.86,11.68 58.67,15.49 A1.35
CH3_AOUT1  (via drill 0.35)
  Top 0.152: U3.5 49.89,28.98 v49.78,29.08
  Top 0.254: v70.36,38.73 71.5,38.73 74.17,41.4 JP16.2
  Bottom 0.254: v49.78,29.08 49.78,33.91 54.61,38.73 v70.36,38.73 | JP16.2 JP16.1 92.24,41.4 92.54,41.1 LIGHT.1
CH3_AOUT2  (via drill 0.35)
  Top 0.152: U3.7 48.59,30.18 v48.64,30.23
  Top 0.254: v68.33,40.64 71.63,43.94 JP16.4
  Bottom 0.254: v48.64,30.23 48.64,35.31 53.98,40.64 v68.33,40.64 | JP16.4 JP16.3 93,43.94 LIGHT.2
CH3_BI0  (via drill 0.35)
  Top 0.152: v51.18,18.16 U3.26
CH3_BI1  (via drill 0.35)
  Top 0.152: v51.82,18.92 51.82,21.06 U3.27
CH3_BIN1  (via drill 0.35)
  Top 0.152: U3.22 48.64,21.03 v48.64,18.16 48.64,14.61 50.55,12.7 54.86,12.7 62.61,20.45 69.47,20.45 A1.37
CH3_BIN2  (via drill 0.35)
  Top 0.152: U3.23 49.28,21.03 v49.28,18.92 49.28,14.73 50.55,13.46 54.99,13.46 64.64,23.11 A1.38
CH3_BOUT1  (via drill 0.35)
  Top 0.152: U3.10 46.61,26.95 v46.61,30.23
  Bottom 0.254: v46.61,30.23 46.61,41.4 54.1,48.9 71.37,48.9 75.95,53.47 JP15.4 JP15.3 92.24,53.47 M4.2
CH3_BOUT2  (via drill 0.35)
  Top 0.152: U3.8 47.88,26.98 v47.88,29.08
  Bottom 0.254: v47.88,29.08 47.88,29.72 47.62,29.97 47.62,40.39 54.74,47.5 73.41,47.5 76.96,51.05 83.57,51.05 JP15.2 JP15.1 93,50.93 M4.1
CH3_DEC  (via drill 0.35)
  Top 0.152: U3.19 46.63,18.95 v46.61,18.92 46.61,14.61 50.04,11.18 55.12,11.18 56.9,12.95 A1.34
CH3_FAULT  (via drill 0.35)
  Top 0.152: U3.18 v45.97,18.16 45.97,14.61 | A1.33 50.16,10.41 45.97,14.61 | R18.2 43.81,14.61 45.97,14.61
CH3_ISA
  Top 0.152: U3.6 49.23,28.63 49.02,28.83 49.02,29.46 49.66,30.1 49.66,36.58 R14.2
CH3_ISB
  Top 0.152: U3.9 47.3,28.14 47.12,28.32 47.12,29.59 47.62,30.1 47.62,31.37 46.99,32 R15.2
CH3_RES
  Top 0.152: U3.16 44.58,20.98 44.58,20.38 42.74,18.54 37.72,18.54 37.08,19.18 37.08,21.59 38.1,22.61 CH3_RESET.2
CH3_SLEEP
  Top 0.152: U3.17 45.34,20.25 43.12,18.03 34.92,18.03 34.16,18.8 34.16,21.21 35.56,22.61 CH3_SLEEP.2
CH3_VREF
  Top 0.152: U3.12 U3.13 44.68,28.22 43.31,29.59 R12.1 R13.2
GND  (via drill 0.35, 0.35 pad 0.55)
  other vias: 51.56,65.41 52.58,65.41 51.56,64.26 52.58,64.26 51.56,63.12 52.58,63.12 51.56,62.1 52.58,62.1 51.56,61.09 52.58,61.09 33.4,50.8 33.4,49.66 33.4,48.51 33.4,47.5 33.4,46.48 32.26,50.8 32.26,49.66 32.26,48.51 32.26,47.5 32.26,46.48 46.1,24.51 47.24,24.51 48.39,24.51 49.4,24.51 50.42,24.51 46.1,23.37 47.24,23.37 48.39,23.37 49.4,23.37 50.42,23.37 43.05,26.92 53.47,21.08 29.97,43.43 35.81,53.85 49.15,58.17 54.99,68.58 41.15,87 38.1,78.49 44.07,78.49 36.45,80.9 45.59,81.53 35.56,87.38 20.95,91.82 20.95,86.87 18.8,84.07 16.51,81.53 12.32,83.19 14.73,85.34 2.92,88.77 3.17,79.88 14.99,78.87 5.59,70.99 10.16,71.12 25.91,52.45 27.56,41.15 28.7,43.43 28.7,42.04 29.97,42.04 27.56,45.59 51.31,30.86 25.15,57.4 24,61.72 19.81,62.87 19.94,66.8 71.63,63.37 74.8,77.98 76.83,80.52 80.01,80.52 76.58,86.23 49.28,78.49 49.28,74.93 51.18,79.88 52.58,76.71 75.69,75.06 79.38,73.03 81.66,73.03 76.33,73.03 44.7,60.96 52.96,35.18 21.34,47.5 23.5,43.56 23.5,42.55 10.41,94.36 7.87,83.95 7.87,75.18 16.64,76.45 19.05,76.58 19.05,78.74 19.43,81.53 20.83,83.95 37.34,96.77 33.27,90.3 35.94,79.12 32.38,77.6 34.29,75.44 40.64,74.8 43.05,72.26 44.45,73.66 45.97,75.18 47.5,81.15 49.4,85.47 55.24,86.87 55.88,83.82 57.4,82.04 55.24,79.88 53.72,81.92 50.93,69.47 52.58,69.6 43.81,69.47 37.34,66.42 30.99,60.96 32.51,60.71 31.24,59.56 35.81,60.45 37.34,60.45 36.45,59.05 45.34,58.29 47.62,58.29 40.26,58.42 31.88,54.48 33.02,54.48 34.16,54.48 9.4,62.36 14.99,69.22 18.16,71.88 9.4,51.94 16.26,58.17 19.43,59.94 27.3,58.17 14.1,55.5 13.59,47.12 9.02,41.53 13.97,37.47 17.78,39.24 20.19,45.72 18.92,33.4 18.03,32 22.61,35.56 31.62,33.66 22.35,33.53 26.8,38.35 22.73,51.44 47.37,44.07 51.82,43.05 50.55,41.53 46.23,42.93 49.53,39.62 44.83,36.2 42.29,38.23 39.37,32.77 57.15,52.07 55.88,50.8 57.15,50.8 49.78,53.47 48.13,53.47 46.1,53.59 44.2,53.59 57.4,42.04 58.93,42.04 57.02,37.21 59.05,37.21 56.39,39.75 36.83,31.24 55.12,22.86 55.12,24.13 55.12,21.46 41.27,15.62 42.8,15.62 44.2,15.62 50.42,15.49 51.69,15.62 53.09,15.62 54.61,15.62 53.85,14.48 52.32,14.48 45.85,12.45 46.99,11.18 48.01,10.03 57.28,11.56 59.31,14.22 61.21,16.64 63.12,19.18 62.74,22.48 61.09,20.95 59.31,19.05 77.47,22.99 75.44,33.53 73.91,35.56 72.14,37.34 72.14,35.31 72.39,31.11 68.07,36.2 68.07,34.8 65.66,35.94 65.53,34.04 65.53,32.13 69.72,39.88 61.72,39.75 77.6,24.64 79.88,24.64 80.01,27.05 80.14,29.72 80.26,32.51 79.25,17.53 62.48,8.76 62.61,11.68 62.74,14.22 73.03,42.67 75.06,42.67 77.09,42.67 79.63,45.34 77.47,45.34 77.6,48.9 79.76,49.02 79.88,52.32 77.47,52.32 77.47,54.74 79.88,54.99 74.55,56.13 77.34,59.05 79.5,61.34 82.55,64.64 77.47,63.25 75.18,61.09 72.52,58.29 81.53,59.31 90.42,52.32 90.3,42.55 66.55,42.16 69.98,45.85 63.37,63.25 60.58,59.69 59.05,59.69 60.96,68.2 60.96,73.15 60.96,77.98 60.96,82.3 60.96,85.34 64.9,85.47 66.55,80.52 76.96,82.68 78.11,88.52 79.88,82.93 82.68,70.1 83.44,77.34 86.23,71.5 86.23,67.94 84.96,62.48 13.08,26.42 16.38,23.62 18.54,26.16 13.34,20.95 13.34,17.91 15.88,20.32 18.92,23.37 40.26,44.96
  pour Top (isolate 0.254): 0,0 100,0 100,100 0,100
  pour Bottom (isolate 0.254): 0,100 100,100 100,0 0,0
N$1
  Top 0.152: U1.1 49.15,68.58 48.39,69.34 48.37,69.33 C3.1
N$2
  Top 0.152: U1.2 47.61,66.95 C3.2
N$3
  Top 0.152: U1.3 44.07,66.29 | 44.07,66.29 43.81,66.29 R1.1 | C4.2 44.05,66.31 44.07,66.29
N$4
  Top 0.152: U2.1 29.97,54.6 C24.1
N$5
  Top 0.152: U2.2 28.55,52.22 27.81,52.96 27.81,54.72 C24.2
N$15
  Top 0.152: U2.3 27.8,51.56 25.71,53.65 | 25.71,53.65 C25.2 | R6.1 25.7,53.65 25.71,53.65
N$16
  Top 0.152: C30.1 52.84,26.56 U3.1
N$17
  Top 0.152: C30.2 52.18,28.31 51.82,27.94 51.84,27.91 U3.2
N$18
  Top 0.152: U3.3 51.18,29.34 R11.1 54.23,31.12 C31.2
V+  (via drill 0.35)
  Top 0.152: U1.4 44.58,65.66 43.56,64.64 C1.1 | U1.11 48.01,61.09 47.24,60.33 44.31,60.33 C2.1 | U2.4 27.43,50.93 26.54,51.82 24.38,51.82 23.76,52.44 R6.2 | R6.2 23.25,53.21 C25.1 | C23.1 23.74,52.72 R6.2 | U2.11 27.05,46.35 26.4,45.71 C22.1 | C31.1 53.46,32.62 R11.2 51.71,32.12 C29.1 50.55,31.76 U3.4 | U3.11 45.97,29.22 C26.1
  Top 0.254: C4.1 42.3,66.54 R1.2 42.68,64.75 C1.1 42.78,63.25 | 42.78,63.25 C2.1 | 42.78,63.25 36.96,63.25 30.35,56.64 24.38,56.64 23.25,55.51 C25.1 | C22.1 26.4,45.61 25.65,46.35 21.34,46.35 | 21.34,46.35 20.57,47.12 20.57,51.7 C23.1 | 21.34,46.35 21.34,42.04 28.83,34.54 40.64,34.54 | 40.64,34.54 43.43,31.75 43.43,30.73 44.07,30.1 44.08,30.11 C26.1 | 40.64,34.54 46.74,40.64 53.34,40.64 54.48,39.5 C31.1
  Top 0.61: GND|PWR.1 7.87,96.01 | 7.87,96.01 GND|PWR.2 | 7.87,96.01 8,95.89 C5.+ 31.37,95.89 35.69,91.57 C14.1 39.77,90.66 5VREG.3 | v34.54,78.11 38.86,73.79 v38.86,73.91 | v42.04,70.74 42.3,70.47 C4.1
  Bottom 0.61: 5VREG.3 34.54,84.96 v34.54,78.11 | v38.86,73.91 v42.04,70.74

### Text on the board
tPlace: Nima Eskandari / TMS320F280049 / BoosterPack